# EAGLE design laser-driver (EAGLE 7.7.0)
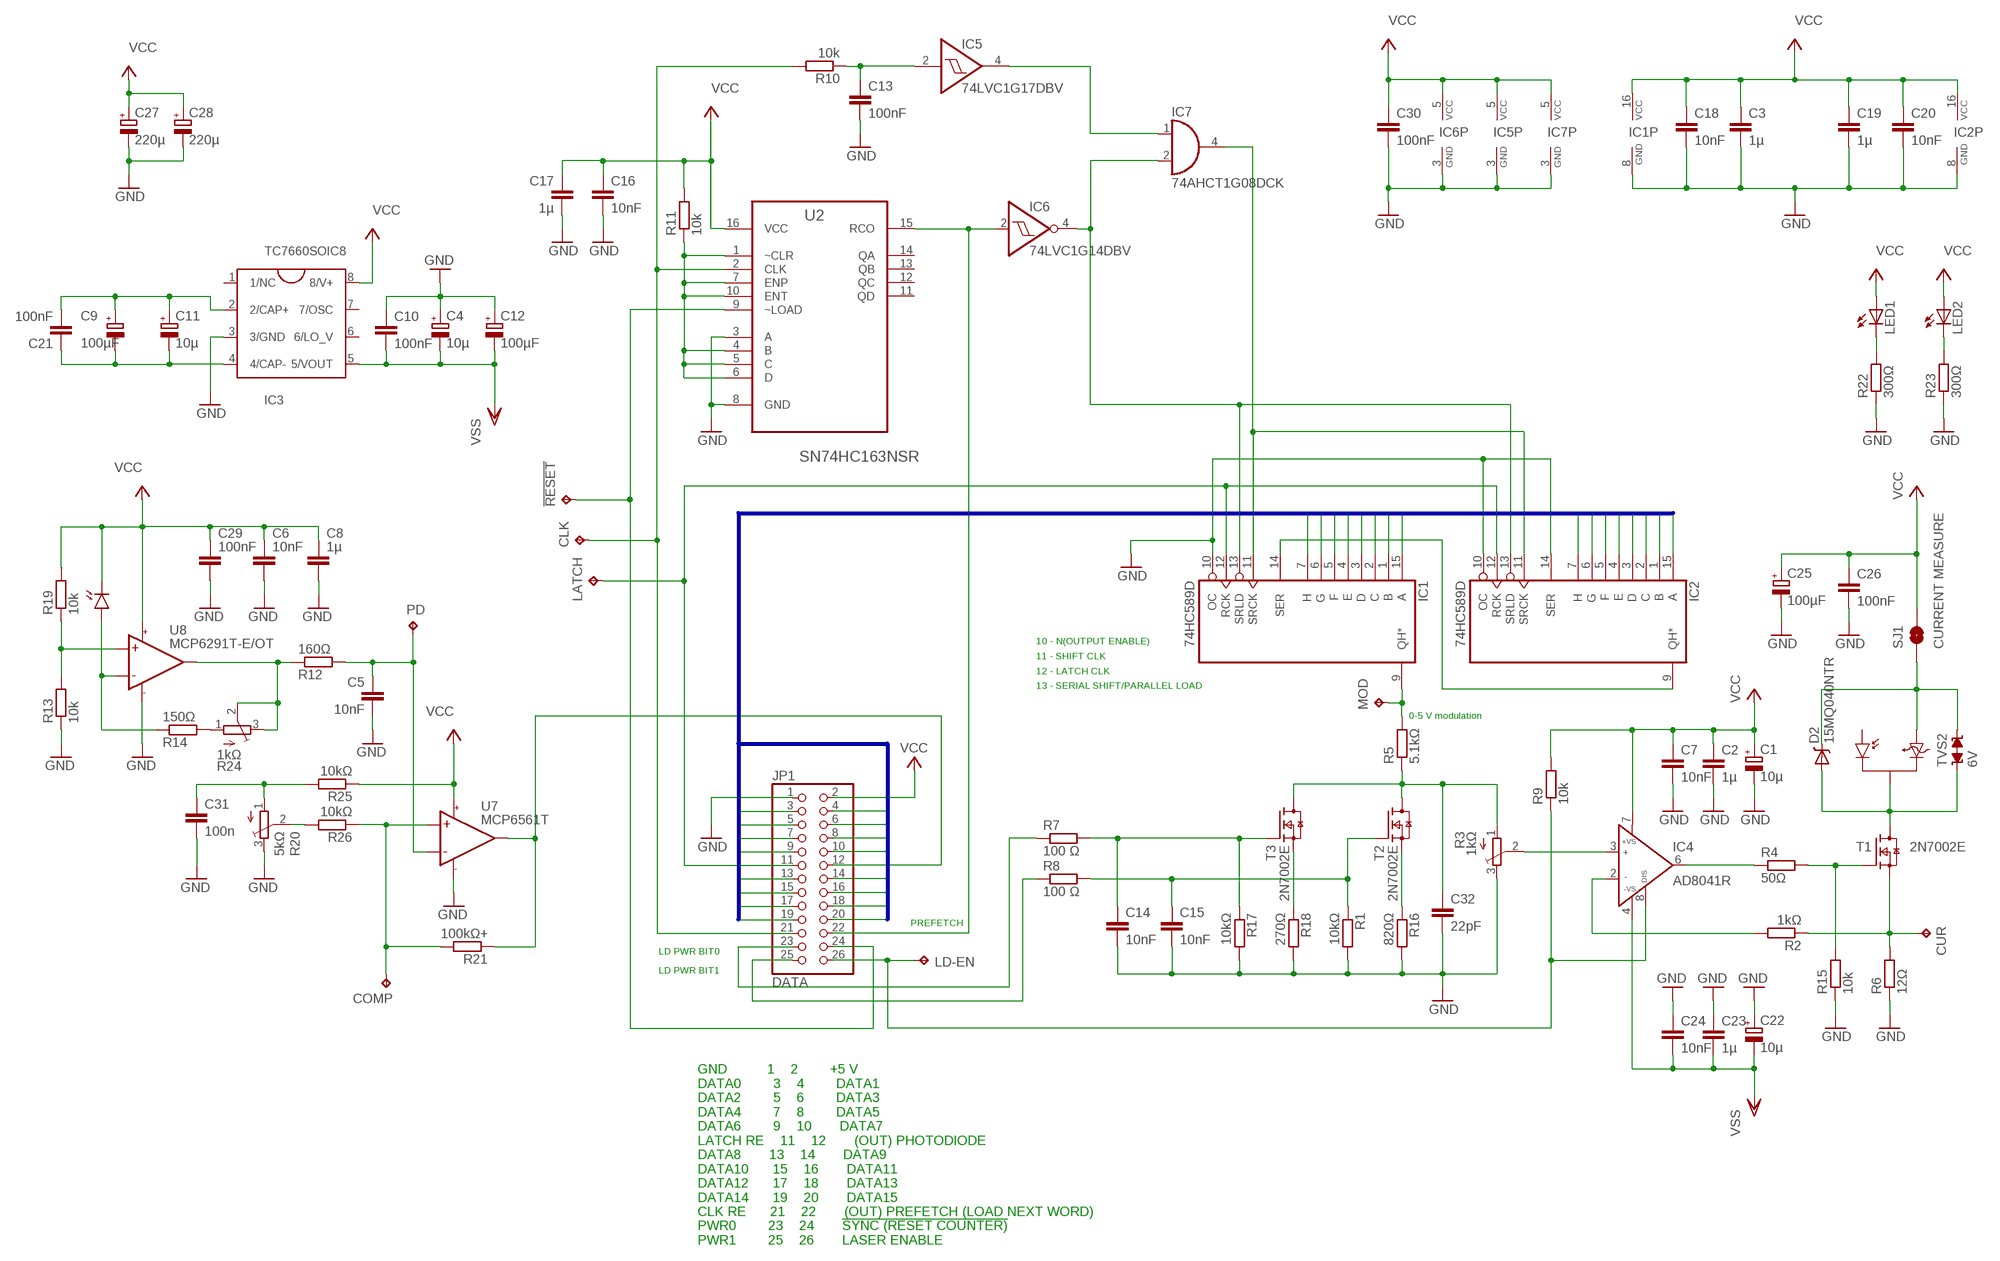
[diagram p0: schematic, sheet 1]

## Parts
!RESET  TPB1,27  [B1,27]
C1  10µ  CPOL-EUA/3216-18R  [A/3216-18R]
C2  1µ  C-EUC1206  [C1206]
C3  1µ  C-EUC1206  [C1206]
C4  10µ  CPOL-EUA/3216-18R  [A/3216-18R]
C5  10nF  C-EUC0603  [C0603]
C6  10nF  C-EUC1206  [C1206]
C7  10nF  C-EUC1206  [C1206]
C8  1µ  C-EUC1206  [C1206]
C9  100µF  CPOL-EUD/7343-31R  [D/7343-31R]
C10  100nF  C-EUC1206  [C1206]
C11  10µ  CPOL-EUA/3216-18R  [A/3216-18R]
C12  100µF  CPOL-EUD/7343-31R  [D/7343-31R]
C13  100nF  C-EUC0603  [C0603]
C14  10nF  C-EUC1206  [C1206]
C15  10nF  C-EUC1206  [C1206]
C16  10nF  C-EUC1206  [C1206]
C17  1µ  C-EUC1206  [C1206]
C18  10nF  C-EUC1206  [C1206]
C19  1µ  C-EUC1206  [C1206]
C20  10nF  C-EUC1206  [C1206]
C21  100nF  C-EUC1206  [C1206]
C22  10µ  CPOL-EUA/3216-18R  [A/3216-18R]
C23  1µ  C-EUC1206  [C1206]
C24  10nF  C-EUC1206  [C1206]
C25  100µF  CPOL-EUD/7343-31R  [D/7343-31R]
C26  100nF  C-EUC0603  [C0603]
C27  220µ  CPOL-EU153CLV-0605  [153CLV-0605]
C28  220µ  CPOL-EU153CLV-0605  [153CLV-0605]
C29  100nF  C-EUC0603  [C0603]
C30  100nF  C-EUC0603  [C0603]
C31  100n  C-EUC0603  [C0603]
C32  22pF  C-EUC0603  [C0603]
CLK  TPB1,27  [B1,27]
COMP  TPB1,27  [B1,27]
CUR  TPB1,27  [B1,27]
D2  15MQ040NTR  DIODE-SCHOTTKY_  [SMA-DIODE]
D3  VTB8441BH  [VTB8441BH]
IC1  74HC589D  [SO16]
IC2  74HC589D  [SO16]
IC3  TC7660SOIC8  [SOIC8]
IC4  AD8041R  [SO8]
IC5  74LVC1G17DBV  [SOT23-5]
IC6  74LVC1G14DBV  [SOT23-5]
IC7  74AHCT1G08DCK  [SC70-5]
JP1  DATA  PINHD-2X13  [2X13]
LATCH  TPB1,27  [B1,27]
LD-EN  TPB1,27  [B1,27]
LED1  LEDCHIPLED_0805  [CHIPLED_0805]
LED2  LEDCHIPLED_0805  [CHIPLED_0805]
MOD  TPB1,27  [B1,27]
PD  TPB1,27  [B1,27]
R1  10kΩ  R-EU_R0603  [R0603]
R2  1kΩ  R-EU_R0603  [R0603]
R3  1kΩ  TRIM_EU-SM-42/43B  [SM-42/43B]
R4  50Ω  R-EU_R0603  [R0603]
R5  5.1kΩ  R-EU_R0603  [R0603]
R6  12Ω  R-EU_R0603  [R0603]
R7  100 Ω  R-EU_R0603  [R0603]
R8  100 Ω  R-EU_R0603  [R0603]
R9  10k  R-EU_R0603  [R0603]
R10  10k  R-EU_R0603  [R0603]
R11  10k  R-EU_R0603  [R0603]
R12  160Ω  R-EU_R0603  [R0603]
R13  10k  R-EU_R0603  [R0603]
R14  150Ω  R-EU_R0603  [R0603]
R15  10k  R-EU_R0603  [R0603]
R16  820Ω  R-EU_R0603  [R0603]
R17  10kΩ  R-EU_R0603  [R0603]
R18  270Ω  R-EU_R0603  [R0603]
R19  10k  R-EU_R0603  [R0603]
R20  5kΩ  TRIM_EU-SM-42/43B  [SM-42/43B]
R21  100kΩ+  R-EU_R0603  [R0603]
R22  300Ω  R-EU_R0603  [R0603]
R23  300Ω  R-EU_R0603  [R0603]
R24  1kΩ  TRIM_EU-3223G  [3223G]
R25  10kΩ  R-EU_R0603  [R0603]
R26  10kΩ  R-EU_R0603  [R0603]
SJ1  CURRENT MEASURE  SOLDERJUMPERNO  [SJ_2S-NO]
T1  2N7002E  [SOT23]
T2  2N7002E  [SOT23]
T3  2N7002E  [SOT23]
TVS2  6V  TVS-0805  [TVS0805]
U2  SN74HC163NSR  [SOIC127P780X200-16N]
U7  MCP6561T  [SOT23-5]
U8  MCP6291T-E/OT  [SOT23-5]
U$1  LASER-LED-COMMON-CATHODE  [TO-18]

## Nets
0…5: IC1.9(QH*) MOD.TP R5.2
GND: C1.- C2.2 C3.2 C4.+ C5.2 C6.2 C7.2 C8.2 C10.1 C12.+ C13.2 C14.2 C15.2 C16.2 C17.2 C18.2 C19.2 C20.2 C22.+ C23.1 C24.1 C25.- C26.2 C27.- C28.- C29.2 C30.2 C31.2 C32.2 IC1.8(GND) IC1.10(OC) IC2.8(GND) IC2.10(OC) IC2.14(SER) IC3.3(3/GND) IC5.3(GND) IC6.3(GND) IC7.3(GND) JP1.1 R1.2 R3.3(E) R6.1 R13.1 R15.1 R16.2 R17.2 R18.2 R20.3(E) R22.1 R23.1 U2.3(A) U2.8(GND) U7.2(VCC-) U8.2(VCC-)
IN0: IC2.15(A) JP1.3
IN1: IC2.1(B) JP1.4
IN2: IC2.2(C) JP1.5
IN3: IC2.3(D) JP1.6
IN4: IC2.4(E) JP1.7
IN5: IC2.5(F) JP1.8
IN6: IC2.6(G) JP1.9
IN7: IC2.7(H) JP1.10
IN8: IC1.15(A) JP1.13
IN9: IC1.1(B) JP1.14
IN10: IC1.2(C) JP1.15
IN11: IC1.3(D) JP1.16
IN12: IC1.4(E) JP1.17
IN13: IC1.5(F) JP1.18
IN14: IC1.6(G) JP1.19
IN15: IC1.7(H) JP1.20
N$1: IC4.8(DISABLE) JP1.26 LD-EN.TP R9.1
N$2: C32.1 R3.1(A) R5.1 T2.3(D) T3.3(D)
N$3: IC4.6(OUT) R4.1
N$4: R4.2 R15.2 T1.1(G)
N$5: D2.A T1.3(D) TVS2.1 U$1.3
N$6: CUR.TP R2.1 R6.2 T1.2(S)
N$7: JP1.23 R7.1
N$8: IC4.3(IN+) R3.2(S)
N$9: C14.1 R7.2 R17.1 T3.1(G)
N$10: JP1.25 R8.1
N$11: !RESET.TP JP1.24 U2.9(~LOAD)
N$12: JP1.12 R21.1 U7.1(OUT)
N$13: C15.1 R1.1 R8.2 T2.1(G)
N$14: IC1.14(SER) IC2.9(QH*)
N$15: C9.+ C11.+ C21.2 IC3.2(2/CAP+)
N$16: IC1.11(SRCK) IC2.11(SRCK) IC7.4(O)
N$17: IC1.13(SRLD) IC2.13(SRLD) IC6.4(O) IC7.2(I1)
N$18: R11.1 U2.1(~CLR) U2.4(B) U2.5(C) U2.6(D) U2.7(ENP) U2.10(ENT)
N$19: COMP.TP R21.2 R26.1 U7.3(IN+)
N$20: IC6.2(I) JP1.22 U2.15(RCO)
N$21: D3.A R14.1 U8.4(IN-)
N$22: CLK.TP JP1.21 R10.2 U2.2(CLK)
N$23: R12.1 R24.2(S) R24.3(E) U8.1(OUT)
N$24: C13.1 IC5.2(I) R10.1
N$25: C9.- C11.- C21.1 IC3.4(4/CAP-)
N$26: IC1.12(RCK) IC2.12(RCK) JP1.11 LATCH.TP
N$27: IC5.4(O) IC7.1(I0)
N$28: R16.1 T2.2(S)
N$29: R18.1 T3.2(S)
N$30: R13.2 R19.1 U8.3(IN+)
N$31: D2.C SJ1.1 TVS2.2 U$1.1
N$32: C5.1 PD.TP R12.2 U7.4(IN-)
N$33: LED1.C R22.2
N$34: LED2.C R23.2
N$35: IC4.2(IN-) R2.2
N$36: R14.2 R24.1(A)
N$37: C31.1 R20.1(A) R25.2
N$38: R20.2(S) R26.2
VCC: C1.+ C2.1 C3.1 C6.1 C7.1 C8.1 C16.1 C17.1 C18.1 C19.1 C20.1 C25.+ C26.1 C27.+ C28.+ C29.1 C30.1 D3.K IC1.16(VCC) IC2.16(VCC) IC3.8(8/V+) IC4.7(+VS) IC5.5(VCC) IC6.5(VCC) IC7.5(VCC) JP1.2 LED1.A LED2.A R9.2 R11.2 R19.2 R25.1 SJ1.2 U2.16(VCC) U7.5(VCC+) U8.5(VCC+)
VSS: C4.- C10.2 C12.- C22.- C23.2 C24.2 IC3.5(5/VOUT) IC4.4(-VS)
Unconnected: IC3.1(1/NC) IC3.6(6/LO_V) IC3.7(7/OSC) U2.11(QD) U2.12(QC) U2.13(QB) U2.14(QA) U$1.2

## Buses
IN[0..15]

## Notes on the sheet
- 10 - N(OUTPUT ENABLE)
  11 - SHIFT CLK
  12 - LATCH CLK
  13 - SERIAL SHIFT/PARALLEL LOAD
- 0-5 V modulation
- PREFETCH
- LD PWR BIT0
- LD PWR BIT1
- GND          1    2        +5 V
  DATA0        3    4        DATA1
  DATA2        5    6        DATA3
  DATA4        7    8        DATA5
  DATA6        9    10       DATA7
  LATCH RE    11    12       (OUT) PHOTODIODE
  DATA8       13    14       DATA9
  DATA10      15    16       DATA11
  DATA12      17    18       DATA13
  DATA14      19    20       DATA15
  CLK RE      21    22       (OUT) PREFETCH (LOAD NEXT WORD)
  PWR0        23    24       !SYNC (RESET COUNTER)
  PWR1        25    26       LASER ENABLE

## Library data of the parts
!RESET CLK COMP CUR LATCH LD-EN MOD PD = testpad:TP: Test pad
C1 C4 C9 C11 C12 C22 C25 C27 C28 = rcl:CPOL-EU: POLARIZED CAPACITOR, European symbol
C2 C3 C5-C8 C10 C13-C21 C23 C24 C26 C29-C32 = rcl:C-EU: CAPACITOR, European symbol
D2 = SparkFun:DIODE-SCHOTTKY
D3 = mulabs:VTB8441BH
IC1 IC2 = 74xx-eu:74*589: 8-bit SHIFT REGISTER, input latch, 3-state
IC3 = microchip2:TC7660: The TC7660 is a pin-compatible replacement for the industry standard 7660 charge pump voltage converter. It converts a +1.5V to +10V input to a corresponding -1.5V to -10V output using only two low cost capacitors, eliminating inductors and their associated cost, size and electromagnetic interference (EMI). The on-board oscillator operates at a nominal frequency of 10 kHz. Operation below 10 kHz (for lower supply current applications) is possible by connecting an external capacitor from OSC to ground. The TC7660 is available in 8-Pin PDIP, 8-Pin Small Outline (SOIC) and 8-Pin CERDIP packages in commercial and extended temperature ranges.
IC4 = analog-devices:AD8041: 160 MHz Rail-to-Rail Amplifier with Disable Source: http://www.analog.com/static/imported-files/data_sheets/AD8041.pdf; MF: ALTERA CORPORATION; MPN: AD8041ARZ; OC_FARNELL: 1464831; OC_NEWARK: 88H0130
IC5 = 74xx-little-de:74*1G17: Single Schmitt-Trigger Buffer
IC6 = 74xx-little-de:74*1G14: Single Schmitt-Trigger Inverter Gate
IC7 = 74xx-little-de:74*1G08: 2-input AND gate
JP1 = pinhead:PINHD-2X13: PIN HEADER
LED1 LED2 = led:LED: LED OSRAM: - CHIPLED LG R971, LG N971, LY N971, LG Q971, LY Q971, LO R971, LY R971 LH N974, LH R974 LS Q976, LO Q976, LY Q976 LO Q996 - Hyper CHIPLED LW Q18S LB Q993, LB Q99A, LB R99A - SideLED LS A670, LO A670, LY A670, LG A670, LP A670 LB A673, LV A673, LT A673, LW A673 LH A674 LY A675 LS A676, LA A676, LO A676, LY A676, LW A676 LS A679, LY A679, LG A679 - Hyper Micro SIDELED® LS Y876, LA Y876, LO Y876, LY Y876 LT Y87S - SmartLED LW L88C, LW L88S LB L89C, LB L89S, LG L890 LS L89K, LO L89K, LY L89K LS L896, LA L896, LO L896, LY L896 - TOPLED LS T670, LO T670, LY T670, LG T670, LP T670 LSG T670, LSP T670, LSY T670, LOP T670, LYG T670 LG T671, LOG T671, LSG T671 LB T673, LV T673, LT T673, LW T673 LH T674 LS T676, LA T676, LO T676, LY T676, LB T676, LH T676, LSB T676, LW T676 LB T67C, LV T67C, LT T67C, LS T67K, LO T67K, LY T67K, LW E67C LS E67B, LA E67B, LO E67B, LY E67B, LB E67C, LV E67C, LT E67C LW T67C LS T679, LY T679, LG T679 LS T770, LO T770, LY T770, LG T770, LP T770 LB T773, LV T773, LT T773, LW T773 LH T774 LS E675, LA E675, LY E675, LS T675 LS T776, LA T776, LO T776, LY T776, LB T776 LHGB T686 LT T68C, LB T68C - Hyper Mini TOPLED® LB M676 - Mini TOPLED Santana® LG M470 LS M47K, LO M47K, LY M47K Source: http://www.osram.convergy.de LUXEON: - LUMILED® LXK2-PW12-R00, LXK2-PW12-S00, LXK2-PW14-U00, LXK2-PW14-V00 LXK2-PM12-R00, LXK2-PM12-S00, LXK2-PM14-U00 LXK2-PE12-Q00, LXK2-PE12-R00, LXK2-PE12-S00, LXK2-PE14-T00, LXK2-PE14-U00 LXK2-PB12-K00, LXK2-PB12-L00, LXK2-PB12-M00, LXK2-PB14-N00, LXK2-PB14-P00, LXK2-PB14-Q00 LXK2-PR12-L00, LXK2-PR12-M00, LXK2-PR14-Q00, LXK2-PR14-R00 LXK2-PD12-Q00, LXK2-PD12-R00, LXK2-PD12-S00 LXK2-PH12-R00, LXK2-PH12-S00 LXK2-PL12-P00, LXK2-PL12-Q00, LXK2-PL12-R00 Source: www.luxeon.com KINGBRIGHT: KA-3528ASYC Source: www.kingbright.com
R1 R2 R4-R19 R21-R23 R25 R26 = rcl:R-EU_: RESISTOR, European symbol
R3 R20 R24 = pot:TRIM_EU-: POTENTIOMETER
SJ1 = SparkFun:SOLDERJUMPER: Solder Jumper Standard SMD solder jumper. Used to automate production. Two varients : Normally Open and Normally Closed are the same, but have different paste layers. NC will have a large amount of paste and should jumper during reflow.
T1-T3 = nxp_60:2N7002: N-channel TrenchMOS FET N-channel enhancement mode Field-Effect Transistor (FET) in a plastic package using TrenchMOS technology. AAL Eindhoven MK
TVS2 = supressor:TVS-: TVS BI-DIRECTIONAL
U2 = Texas Instruments_By_element14_Batch_1:SN74HC163NSR: 4-Bit Synchronus Binary Counters; MPN: SN74HC163NSR; OC_FARNELL: 1236219; OC_NEWARK: 13M5211; PACKAGE: SOIC-16; SUPPLIER: Texas Instruments
U7 = mulabs:MCP6561T: Rail-to-Rail Comparator
U8 = mulabs:MCP6291T-E/OT: OP AMP, 10MHZ, SINGLE
U$1 = mulabs:LASER-LED-COMMON-CATHODE

## Board
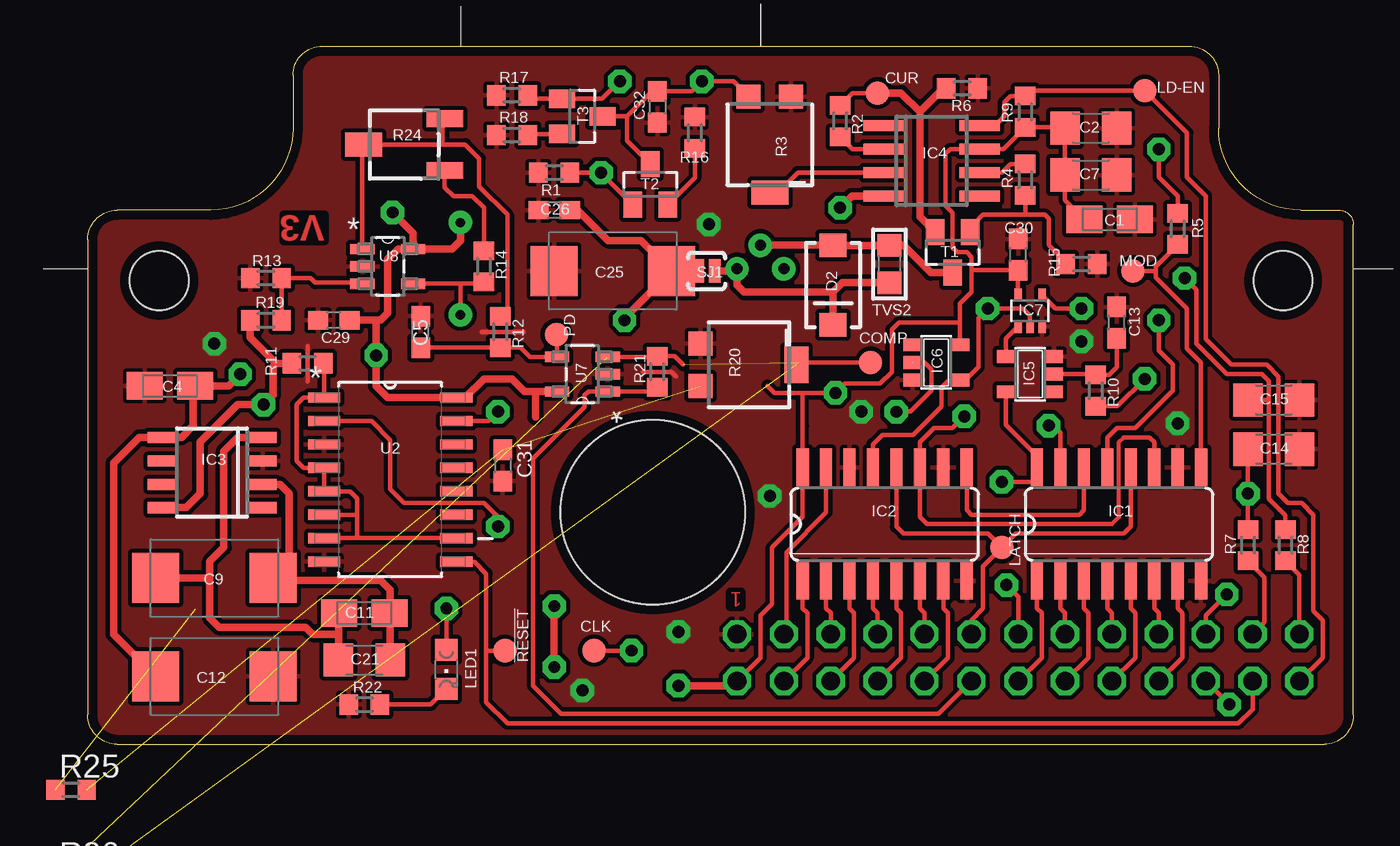
[diagram p1: board, top side]
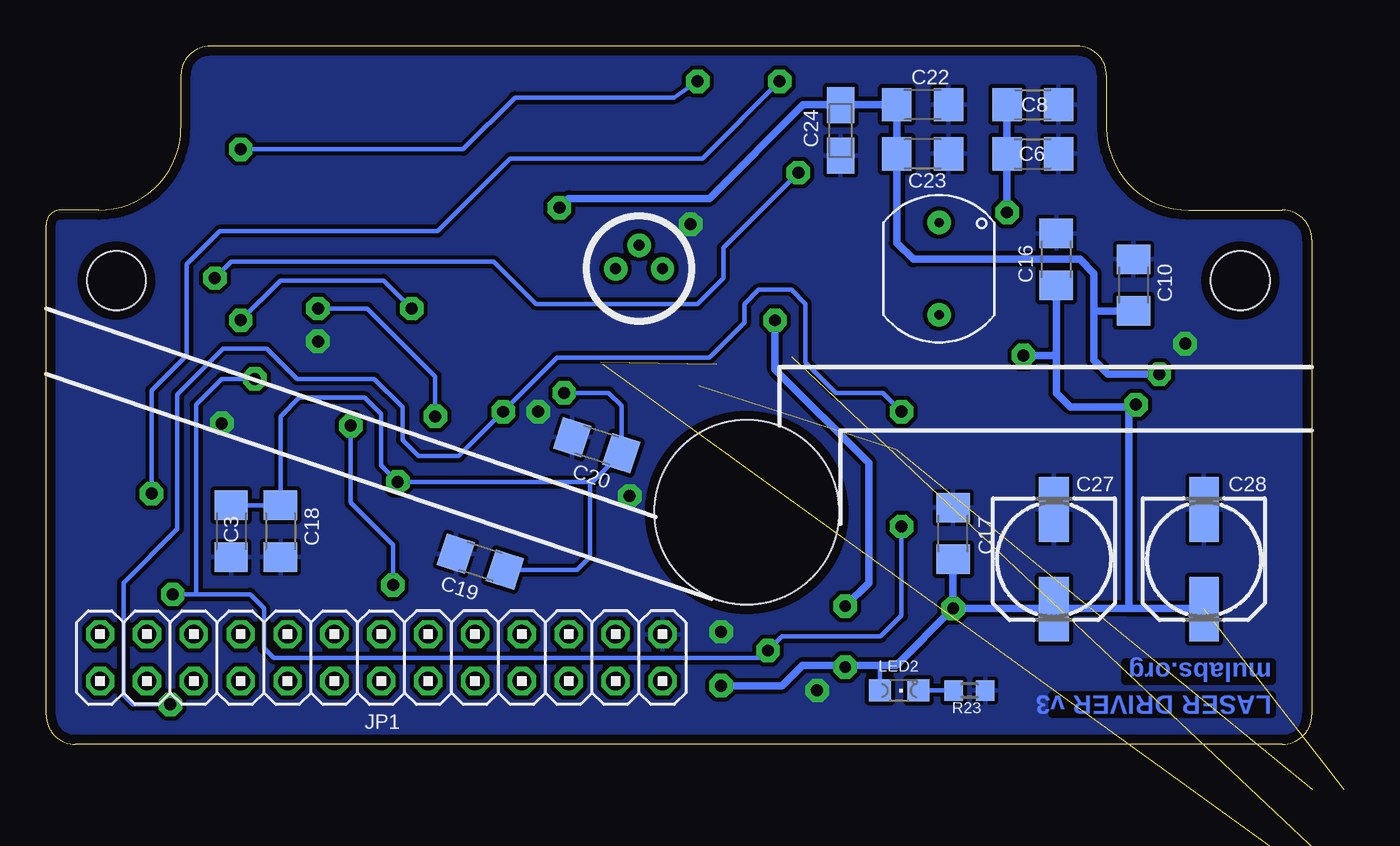
[diagram p2: board, bottom side, seen from below]

Size 68.58 x 37.85 mm. Coordinates in mm from the lower left corner, seen from the top.
Outline: 11.11,36.26 arc-90 12.7,37.85 59.69,37.85 arc-90 61.28,36.26 61.28,33.4 arc90 65.72,28.96 67.74,28.96 arc-94 68.58,28.17 68.58,1.59 arc-90 66.99,0 1.59,0 arc-90 0,1.59 0,27.37 arc-90 1.59,28.96 6.67,28.96 arc90 11.11,33.4 11.11,36.26
Copper layers (1*16): Top 0.07mm / dielectric 1.5mm / Bottom 0.07mm
Design rules "default *": minimum track width 10mil, minimum drill 24mil, track to track 8mil, track to pad 8mil, pad to pad 8mil, via to via 8mil, smd to smd 8mil, copper to edge 20mil, drill to drill 8mil, minimum pad ring 10mil, minimum via ring 8mil, stop-mask expansion 4mil, vias tented up to drill 0mil, thermal gap 8mil
Holes 3.2 mm at 3.87,25.15 64.77,25.15
Holes 10 mm at 30.61,12.57
bKeepout: area 27.9,18.8 to 57.4,35.9

### Footprints (pad centres in the part's own frame; a part is rotated, then mirrored left to right if it is on the bottom)
B1,27 = smd 1.27 x 1.27: TP 0,0
A/3216-18R = smd 1.95 x 1.5: + 1.375,0; - -1.375,0
C1206 = smd 1.6 x 1.8: 1 -1.4,0; 2 1.4,0
C0603 = smd 1.1 x 1: 1 -0.85,0; 2 0.85,0
D/7343-31R = smd 2.55 x 2.7: + 3.175,0; - -3.175,0
153CLV-0605 = smd 3.5 x 1.6: + 2.7,0; - -2.7,0
SMA-DIODE = smd 1.27 x 1.47: A -2.15,0; C 2.15,0
VTB8441BH = drill 0.508 pad 1.27: A 0,-2.5; K 0,2.5
SO16 = smd 0.66 x 2.032: 1 -4.445,-3.073; 2 -3.175,-3.073; 3 -1.905,-3.073; 4 -0.635,-3.073; 5 0.635,-3.073; 6 1.905,-3.073; 7 3.175,-3.073; 8 4.445,-3.073; 9 4.445,3.073; 10 3.175,3.073; 11 1.905,3.073; 12 0.635,3.073; 13 -0.635,3.073; 14 -1.905,3.073; 15 -3.175,3.073; 16 -4.445,3.073
SOIC8 = smd 0.6 x 1.5: 1 -1.905,-2.75; 2 -0.635,-2.75; 3 0.635,-2.75; 4 1.905,-2.75; 5 1.905,2.75; 6 0.635,2.75; 7 -0.635,2.75; 8 -1.905,2.75
SO8 = smd 0.6 x 2.2: 1 -1.905,-2.6; 2 -0.635,-2.6; 3 0.635,-2.6; 4 1.905,-2.6; 5 1.905,2.6; 6 0.635,2.6; 7 -0.635,2.6; 8 -1.905,2.6
SOT23-5 = smd 0.69 x 0.99: 1 -0.95,-1.29; 2 0,-1.29; 3 0.95,-1.29; 4 0.95,1.3; 5 -0.95,1.3
SC70-5 = smd 0.4 x 0.7: 1 -0.65,-0.85; 2 0,-0.85; 3 0.65,-0.85; 4 0.65,0.85; 5 -0.65,0.85
2X13 = drill 1.016 octagon: 1 -15.24,-1.27; 2 -15.24,1.27; 3 -12.7,-1.27; 4 -12.7,1.27; 5 -10.16,-1.27; 6 -10.16,1.27; 7 -7.62,-1.27; 8 -7.62,1.27; 9 -5.08,-1.27; 10 -5.08,1.27; 11 -2.54,-1.27; 12 -2.54,1.27; 13 0,-1.27; 14 0,1.27; 15 2.54,-1.27; 16 2.54,1.27; 17 5.08,-1.27; 18 5.08,1.27; 19 7.62,-1.27; 20 7.62,1.27; 21 10.16,-1.27; 22 10.16,1.27; 23 12.7,-1.27; 24 12.7,1.27; 25 15.24,-1.27; 26 15.24,1.27
CHIPLED_0805 = smd 1.2 x 1.2: A 0,-1.05; C 0,1.05
R0603 = smd 1 x 1.1: 1 -0.85,0; 2 0.85,0
SM-42/43B = smd 1.3 x 1.3: 1 2.6,1.15; 3 2.6,-1.15 | smd 1.3 x 2: 2 -2.6,0
3223G = smd 2 x 0.9: 1 -2.2,1.4; 3 -2.2,-1.4 | smd 2 x 1.3: 2 2.2,0
SJ_2S-NO = smd 0.635 x 1.27: 1 -0.45,0; 2 0.45,0
SOT23 = smd 1 x 1.4: 1 -0.95,-1.1; 2 0.95,-1.1; 3 0,1.1
TVS0805 = smd 1.2 x 1.3: 1 -1.016,0; 2 1.016,0
SOIC127P780X200-16N = smd 1.753 x 0.559: 1 -3.581,4.445; 2 -3.581,3.175; 3 -3.581,1.905; 4 -3.581,0.635; 5 -3.581,-0.635; 6 -3.581,-1.905; 7 -3.581,-3.175; 8 -3.581,-4.445; 9 3.581,-4.445; 10 3.581,-3.175; 11 3.581,-1.905; 12 3.581,-0.635; 13 3.581,0.635; 14 3.581,1.905; 15 3.581,3.175; 16 3.581,4.445
SOT23-5' = smd 1.321 x 0.559: 1 -1.372,0.94; 2 -1.372,0; 3 -1.372,-0.94; 4 1.372,-0.94; 5 1.372,0.94
TO-18 = drill 0.6 pad 1.27: 1 -1.27,0; 2 1.27,0; 3 0,-1.27

### Placement (x,y rotation side)
!RESET  22.61,5.08 0 top
C1  55.37,28.45 180 top
C2  54.36,33.4 0 top
C3  58.55,11.56 270 bottom
C4  4.45,19.43 180 top
C5  18.03,22.35 90 top
C6  15.11,32 0 bottom
C7  54.36,30.86 0 top
C8  15.11,34.67 0 bottom
C9  6.86,9.02 0 top
C10  9.65,24.89 270 bottom
C11  14.99,7.11 0 top
C12  6.86,3.68 0 top
C13  55.75,22.86 90 top
C14  64.26,16 0 top
C15  64.26,18.67 0 top
C16  13.84,26.29 90 bottom
C17  19.43,11.43 90 bottom
C18  55.88,11.56 270 bottom
C19  45.05,9.9 162 bottom
C20  38.74,16.22 162 bottom
C21  14.99,4.57 0 top
C22  25.53,33.27 270 bottom
C23  21.08,32 180 bottom
C24  21.08,34.67 180 bottom
C25  28.45,25.65 0 top
C26  25.27,28.96 180 top
C27  13.97,10.03 270 bottom
C28  5.84,10.03 270 bottom
C29  13.34,22.99 180 top
C30  50.42,26.54 90 top
C31  22.48,15.11 270 top
C32  30.86,34.54 270 top
CLK  27.43,5.08 0 top
COMP  42.42,20.7 0 top
CUR  42.8,35.31 0 top
D2  40.39,24.89 270 top
D3  20.19,25.78 0 bottom
IC1  55.88,11.94 0 top
IC2  43.18,11.94 0 top
IC3  6.73,14.73 90 top
IC4  45.72,31.62 270 top
IC5  51.05,20.07 90 top
IC6  45.97,20.7 270 top
IC7  51.05,23.5 0 top
JP1  50.42,4.7 180 bottom
LATCH  49.53,10.67 0 top
LD-EN  57.28,35.43 0 top
LED1  19.43,4.06 180 top
LED2  22.35,2.92 270 bottom
MOD  56.64,25.65 0 top
PD  25.4,22.23 90 top
R1  25.27,30.99 180 top
R2  40.77,33.78 270 top
R3  36.96,32.51 90 top
R4  50.8,30.61 270 top
R5  59.05,27.94 270 top
R6  47.37,35.56 180 top
R7  62.87,10.8 90 top
R8  64.9,10.8 90 top
R9  50.8,34.29 270 top
R10  54.61,19.18 270 top
R11  11.91,20.65 180 top
R12  22.35,22.35 270 top
R13  9.65,25.27 0 top
R14  21.46,25.91 90 top
R15  53.85,26.04 180 top
R16  32.89,33.15 90 top
R17  22.99,35.18 180 top
R18  22.99,33.02 180 top
R19  9.65,22.99 180 top
R20  35.81,20.57 180 top
R21  30.86,20.19 90 top
R22  14.99,2.16 0 top
R23  18.54,2.92 180 bottom
R24  17.14,32.51 180 top
R25  -0.91,-2.46 0 top
R26  -0.91,-7.21 0 top  (outside the outline)
SJ1  33.53,25.65 180 top
T1  46.86,26.67 180 top
T2  30.48,30.35 0 top
T3  26.8,34.04 270 top
TVS2  43.43,26.04 270 top
U2  16.38,14.35 0 top
U7  MCP6561T  [SOT23-5']  26.8,20.07 180 top
U8  MCP6291T-E/OT  [SOT23-5']  16.26,25.91 0 top
U$1  36.45,25.78 180 bottom

### Tracks (layer width: path | path; a pad name or v marks a point on that pad's centre or on a via)
0…5
  Top 0.254: IC1.9 60.33,20.7 59.56,21.46 59.56,23.62 57.87,25.31 57.87,25.65 | R5.2 57.87,25.91 57.87,25.65 | MOD.TP 57.87,25.65
GND  (via drill 0.65 pad 1.27)
  Top 0.254: 23.62,22.35 21.34,22.35 | 30.1,20.19 31.62,20.19 31.88,19.94 | 11.91,19.68 11.91,21.58
  other vias: 41.91,18.03 6.86,21.72 32,6.1 33.66,28.19 53.85,21.84 26.8,2.92 59.05,17.4 36.96,13.46
  pour Top (isolate 0.229): 0,38.35 0,0 68.58,0 68.58,38.35
  pour Bottom (isolate 0.229): 0,38.35 0,0 68.58,0 68.58,38.35
IN0
  Top 0.254: IC2.15 40.01,12.57 37.85,10.41 37.85,5.97 JP1.3
IN1
  Top 0.254: IC2.1 38.73,7.37 38.99,7.11 38.99,4.7 JP1.4
IN2
  Top 0.254: IC2.2 40.01,7.37 40.26,7.11 JP1.5
IN3
  Top 0.254: IC2.3 41.27,7.37 41.53,7.11 41.53,4.7 JP1.6
IN4
  Top 0.254: IC2.4 42.55,7.37 42.8,7.11 JP1.7
IN5
  Top 0.254: IC2.5 43.81,7.37 44.07,7.11 44.07,4.7 JP1.8
IN6
  Top 0.254: IC2.6 45.09,7.37 45.34,7.11 JP1.9
IN7
  Top 0.254: IC2.7 46.36,7.37 46.61,7.11 46.61,4.7 JP1.10
IN8  (via drill 0.65 pad 1.27)
  Top 0.254: JP1.13 50.42,8 v49.78,8.64 | v52.07,17.27 52.32,17.27 52.7,16.89 IC1.15
  Bottom 0.254: v49.78,8.64 49.78,10.82 52.07,13.11 v52.07,17.27
IN9
  Top 0.254: IC1.1 51.44,7.37 51.69,7.11 51.69,4.7 JP1.14
IN10
  Top 0.254: IC1.2 52.7,7.37 52.96,7.11 JP1.15
IN11
  Top 0.254: IC1.3 53.98,7.37 54.23,7.11 54.23,4.7 JP1.16
IN12
  Top 0.254: IC1.4 55.24,7.37 55.5,7.11 JP1.17
IN13
  Top 0.254: IC1.5 56.52,7.37 56.77,7.11 56.77,4.7 JP1.18
IN14
  Top 0.254: IC1.6 57.79,7.37 58.04,7.11 JP1.19
IN15
  Top 0.254: IC1.7 59.05,7.37 59.31,7.11 59.31,4.7 JP1.20
N$1
  Top 0.254: JP1.26 66.93,4.7 66.93,6.73 66.42,7.24 66.42,12.45 65.79,13.08 65.02,13.08 64.52,13.59 64.52,19.94 63.88,20.57 61.98,20.57 60.58,21.97 60.58,29.72 59.56,30.73 59.56,33.15 LD-EN.TP 51.09,35.43 R9.1 | R9.1 50.38,35.14 | IC4.8 49.15,33.53 49.66,34.04 49.66,34.8 50,35.14 R9.1
N$2  (via drill 0.65 pad 1.27)
  Top 0.254: v58.04,32.26 58.04,30.73 59.05,29.72 R5.1 | 36,35.05 R3.1 34.98,35.94 v33.27,35.94 32.73,35.39 C32.1 30.57,35.39 29.21,34.04 | T3.3 29.21,34.04 | 29.21,34.04 29.21,32.72 T2.3
  Bottom 0.254: v58.04,32.26 45.97,32.26 43.18,35.05 34.54,35.05 v33.27,35.94
N$3
  Top 0.254: IC4.6 49.53,30.99 50,31.46 R4.1
N$4
  Top 0.254: R15.2 53,26.12 52.07,27.05 52.07,28.49 51.86,28.7 50.8,28.7 | 50.76,29.72 R4.2 50.8,28.7 | 50.8,28.7 48.51,28.7 48.01,28.19 48.01,27.96 T1.1
N$5
  Top 0.406: T1.3 45.68,25.57 44.2,27.05 TVS2.1 43.17,27.04 D2.A 40.38,27.05 U$1.3
N$6
  Top 0.254: CUR.TP 41.44,35.31 R2.1
  Top 0.406: CUR.TP 44.07,35.31 45.09,34.29 | 45.09,34.29 45.09,28.6 T1.2 | R6.2 46.36,35.56 45.09,34.29
N$7
  Top 0.254: 63.12,10.2 R7.1 63.75,9.06 63.75,6.6 JP1.23
N$8
  Top 0.254: IC4.3 38.48,30.99 37.41,29.91 R3.2
N$9  (via drill 0.65 pad 1.27)
  Top 0.254: R7.2 v62.87,13.59 C14.1 | R17.1 24.16,34.99 T3.1 27.87,34.99 v28.83,35.94
  Bottom 0.254: v28.83,35.94 33.02,31.75 43.43,31.75 47.37,27.81 59.18,27.81 60.96,26.04 60.96,21.08 62.87,19.18 v62.87,13.59
N$10
  Top 0.254: JP1.25 65.66,9.18 R8.1
N$11
  Top 0.254: JP1.24 63.12,1.91 62.36,1.14 22.73,1.14 21.59,2.29 21.59,5.08 | U2.9 20.96,9.88 21.59,9.25 21.59,5.08 | !RESET.TP 21.59,5.08
N$12
  Top 0.254: JP1.12 46.1,1.65 25.65,1.65 24.13,3.17 24.13,15.49 26.92,18.29 26.92,18.92 27.13,19.13 U7.1 30.64,19.13 R21.1 arc-45 30.9,19.63
N$13  (via drill 0.65 pad 1.27)
  Top 0.254: 64.01,18.67 64.01,19.69 63.63,20.07 61.72,20.07 60.07,21.72 60.07,24.64 v59.44,25.27 | 64.01,18.67 64.01,13.3 64.9,12.41 R8.2 | C15.1 64.01,18.67 | R1.1 v27.81,30.99 27.81,30.97 T2.1
  Bottom 0.254: v59.44,25.27 58.55,26.16 44.32,26.16 42.04,23.88 33.27,23.88 31.88,25.27 31.88,26.92 v27.81,30.99
N$14
  Top 0.254: IC1.14 53.98,12.7 53.72,12.45 47.88,12.45 47.62,12.7 47.62,14.99 IC2.9
N$15
  Top 0.254: 16.38,7.13 C11.+ | 10.92,9.14 C9.+ 10.16,8.89 | 16.39,4.6 C21.2
  Top 0.406: 16.38,7.13 16.38,8.38 15.88,8.89 10.16,8.89 | IC3.2 10.41,14.1 10.92,13.59 10.92,9.14 | C11.+ 16.39,7.11 C21.2
N$16  (via drill 0.65 pad 1.27)
  Top 0.203: 55.5,11.94 55.88,12.32 55.88,16.38 56.13,16.64
  Top 0.254: 55.5,11.94 45.47,11.94 45.09,12.32 IC2.11 45.09,16.38 45.85,17.14 46.86,17.14 v47.5,17.78 | 56.13,16.64 57.53,16.64 57.79,16.38 IC1.11 | v53.85,23.62 52.43,23.62 IC7.4
  Bottom 0.254: v53.85,23.62 51.18,23.62 47.5,19.94 v47.5,17.78
N$17  (via drill 0.65 pad 1.27)
  Top 0.254: IC2.13 42.55,16.26 43.05,16.76 44.7,16.76 46.26,18.32 46.26,19.33 46.61,19.69 47.21,19.69 IC6.4 47.56,19.75 48.26,20.45 48.26,23.11 v48.77,23.62 50.67,23.62 51.05,23.24 IC7.2 | IC1.13 55.24,16.64 55.75,17.14 56.77,17.14 58.8,19.18 58.8,20.57 58.04,21.34 v58.04,22.99
  Bottom 0.254: v58.04,22.99 55.88,25.15 50.29,25.15 v48.77,23.62
N$18
  Top 0.254: U2.7 14.61,11.18 | 14.61,11.18 U2.10 | 14.61,12.45 14.61,13.34 14.22,13.72 U2.5 U2.4 11.68,14.99 11.3,15.37 11.3,18.41 11.68,18.8 U2.1 12.8,20.61 R11.1 | 14.61,12.45 14.61,11.18 | U2.6 14.61,12.45
N$19  (2 unrouted)
  Top 0.254: 38.54,20.7 COMP.TP | U7.3 30.82,21.01 R21.2 31.79,21.04 32.26,20.57
N$20  (via drill 0.64 pad 1.27, 0.65 pad 1.27)
  Top 0.254: v61.85,2.16 JP1.22 | U2.15 21.72,17.53 v22.23,18.03 | v43.81,18.03 44.58,18.03 45.72,19.18 45.72,20.32 45.34,20.7 IC6.2
  Bottom 0.254: v61.85,2.16 63.88,2.16 64.39,2.67 64.39,8.76 61.47,11.68 61.47,18.97 58.97,21.46 56.64,21.46 54.99,19.81 50.8,19.81 49.28,18.29 49.28,16.51 48.39,15.62 46.23,15.62 v43.81,18.03 40.89,20.96 32.64,20.96 30.73,22.86 30.73,23.88 29.97,24.64 28.19,24.64 27.43,23.88 27.43,20.7 25.78,19.05 23.24,19.05 v22.23,18.03
N$21
  Top 0.254: U8.4 20.19,24.97 | 20.19,24.97 D3.A | 20.19,24.97 21.37,24.97 R14.1
N$22  (via drill 0.64 pad 1.27, 0.65 pad 1.27)
  Top 0.254: U2.2 15.37,17.53 16.38,16.51 16.38,13.84 17.14,13.08 21.46,13.08 22.23,12.32 v22.23,11.81 | JP1.21 60.58,6.99 v61.72,8.13 | R10.2 55.79,18.33 v57.28,19.81 | CLK.TP v29.46,5.08
  Bottom 0.254: v61.72,8.13 60.45,8.13 | 60.45,8.13 57.53,8.13 56.77,7.37 56.77,5.21 56.26,4.7 29.84,4.7 v29.46,5.08 28.7,5.84 23.37,5.84 22.23,6.99 v22.23,11.81 | v57.28,19.81 59.05,19.81 60.45,18.41 60.45,8.13
N$23
  Top 0.254: 18.8,33.78 19.21,33.78 | 19.21,33.78 R24.3 | U8.1 14.86,26.87 14.86,32.43 R24.2 19.3,32.51 | 19.3,32.51 20.45,32.51 21.21,31.75 21.21,30.23 22.73,28.7 22.73,23.58 R12.1 | 19.21,33.78 19.21,32.6 19.3,32.51
N$24
  Top 0.254: C13.1 55.75,20.45 55.33,20.03 R10.1 54.57,20.07 IC5.2
N$25
  Top 0.406: C9.- 6.6,9.02 | IC3.4 8.13,16.64 7.37,15.88 7.37,10.67 6.6,9.91 6.6,9.02 | 6.6,9.02 6.6,6.86 7.11,6.35 11.81,6.35 12.19,5.97 13.59,5.97 | 13.59,5.97 C21.1 | 13.59,5.97 13.59,7.11 C11.-
N$26
  Top 0.254: JP1.11 47.88,6.73 48.51,7.37 48.51,9.65 LATCH.TP | IC1.12 56.52,11.81 56.13,11.43 50.29,11.43 LATCH.TP | IC2.12 43.81,11.81 44.2,11.43 48.77,11.43 LATCH.TP
N$27
  Top 0.254: IC5.4 49.75,22 IC7.1
N$28
  Top 0.254: R16.1 32.89,30.72 T2.2
N$29
  Top 0.254: T3.2 24.03,33.09 R18.1
N$30
  Top 0.254: U8.3 14.83,25.02 12.32,25.02 12.07,25.27 R13.2 R19.1
N$31
  Top 0.406: TVS2.2 40.89,25.02 40.39,24.51 40.39,24.38 | 40.39,24.38 D2.C | 40.39,24.38 40.26,24.51 35.56,24.51 35.18,24.89 U$1.1 35.05,25.65 SJ1.1
N$32
  Top 0.254: PD.TP 25.43,22.2 U7.4 23.95,21.01 23.46,21.5 R12.2 C5.1
N$33
  Top 0.254: R22.2 18.58,2.16 LED1.C
N$34
  Bottom 0.254: R23.2 LED2.C
N$35
  Top 0.254: IC4.2 41.44,32.26 R2.2
N$36
  Top 0.254: R14.2 21.46,29.08 20.83,29.72 19.81,29.72 19.35,30.19 R24.1
N$37  (2 unrouted)
N$38  (1 unrouted)
VCC  (via drill 0.64 pad 1.27, 0.65 pad 1.27)  (1 unrouted)
  Top 0.254: JP1.2 36.45,4.7 36.45,6.99 37.08,7.62 37.08,10.67 38.73,12.32 IC2.16 | v49.53,14.22 51.18,14.22 51.44,14.48 IC1.16 51.44,15.62 49.75,17.3 IC5.5 | IC2.16 38.73,17.27 | LED1.A v19.43,7.37 | C1.+ 52.96,29.49 C7.1 C2.1 52.92,33.44 R9.2 49.62,32.26 IC4.7 46.74,32.26 46.48,32 46.48,29.21 46.86,28.83 46.86,26.92 47.12,26.67 47.62,26.67 47.88,26.42 47.88,25.65 | IC7.5 50.4,25.65 | 50.4,25.65 50.4,26.06 | 47.25,22.86 47.25,23.89 47.88,24.51 47.88,25.65 | 47.25,22.86 47.25,21.67 IC6.5 | 47.88,25.65 47.92,25.69 C30.1 50.42,25.67 50.4,25.65 | 47.25,22.86 43.94,22.86 43.56,22.48 43.56,20.19 42.93,19.56 41.02,19.56 v40.51,19.05 38.73,19.05 | 36.84,19.42 37.21,19.05 38.73,19.05 | IC2.16 38.73,19.05 | 15.88,22.99 15.75,22.99 15.62,22.86 | 14.22,22.95 C29.1
  Top 0.406: U8.5 16.82,26.85 16.26,26.29 16.26,23.37 15.88,22.99 | IC3.8 5.33,12.83 6.1,13.59 6.1,16.38 8.13,18.41 v9.52,18.41 10.03,18.92 10.03,20.47 10.21,20.65 | v32,3.17 34.93,3.17 JP1.2 | U8.5 19.74,26.85 20.19,27.3 D3.K | 31.95,24.57 C25.+ | SJ1.2 C25.+ | C26.1 26.54,28.96 28.19,27.3 29.97,27.3 C25.+ | v29.08,22.99 29.08,23.11 C25.+ | U7.5 24.13,19.13 | 24.13,19.13 23.67,19.13 22.99,19.81 21.46,19.81 20.45,18.8 U2.16 16.26,18.8 15.62,19.43 v15.62,21.08 15.62,22.86 | v25.27,7.49 v25.27,4.19 | U8.5 17.63,27.71 v16.51,28.83 | C29.1 15.75,22.99 | R19.2 8.8,22.06 10.21,20.65 | R11.2 10.21,20.65 | 24.13,19.13 24.26,19 24.26,17.74
  Bottom 0.254: C3.1 C18.1 55.88,17.78 54.86,18.8 51.31,18.8 50.42,17.91 50.42,15.11 v49.53,14.22 39.1,14.22 | 43.69,9.49 C19.1 39.81,9.47 39.12,10.16 39.12,14.21 39.1,14.22 | C6.1 | 39.1,14.22 38.97,14.22 C20.1 37.41,18.36 38.1,19.05 v40.51,19.05 | LED2.A 23.4,4.19 23.5,4.29
  Bottom 0.406: C6.1 C8.1 | 9.91,7.37 9.91,18.03 9.65,18.29 | 25.27,4.29 23.5,4.29 22.51,4.29 v19.43,7.37 | 25.27,4.29 27.59,4.29 28.7,3.17 v32,3.17 | v16.51,28.83 C6.1 | 9.65,18.29 v9.52,18.41 | v25.27,7.49 24,8.76 24,15.24 29.08,20.32 v29.08,22.99 | v25.27,4.19 25.27,4.29 | v19.43,7.37 14,7.37 C27.+ 13.94,7.37 9.91,7.37 | 9.91,7.37 5.87,7.37 C28.+ | v19.43,7.37 C17.1 | 9.65,18.29 13.08,18.29 13.84,19.05 13.84,21.08 | 13.84,21.08 C16.1 | v15.62,21.08 13.84,21.08
VSS  (via drill 0.65 pad 1.27)
  Top 0.406: C12.- 1.4,5.97 1.4,15.24 2.79,16.64 IC3.5 5.08,16.64 5.72,17.27 5.72,19.33 C4.- 7.62,19.43 v8.25,20.07 | IC4.4 41.4,29.72 v40.77,29.08
  Bottom 0.254: 25.89,34.67 C22.- 25.93,34.67 | C23.2
  Bottom 0.406: C23.2 C24.2 25.89,34.67 | v40.77,29.08 40.26,29.59 32.64,29.59 27.56,34.67 25.93,34.67 | v8.25,20.07 11.05,20.07 11.81,20.83 11.81,23.37 | C23.2 22.48,27.18 21.59,26.29 12.57,26.29 11.81,25.53 11.81,23.37 | C10.2 11.69,23.49 11.81,23.37

### Text on the board
Top: V3 | 1
Bottom: mulabs.org | LASER DRIVER v3